# EasyEDA Pro project ProPrj_通用工程PCB-Update-V3.1_2025-07-16.epro, board [PCB]Driver_Board
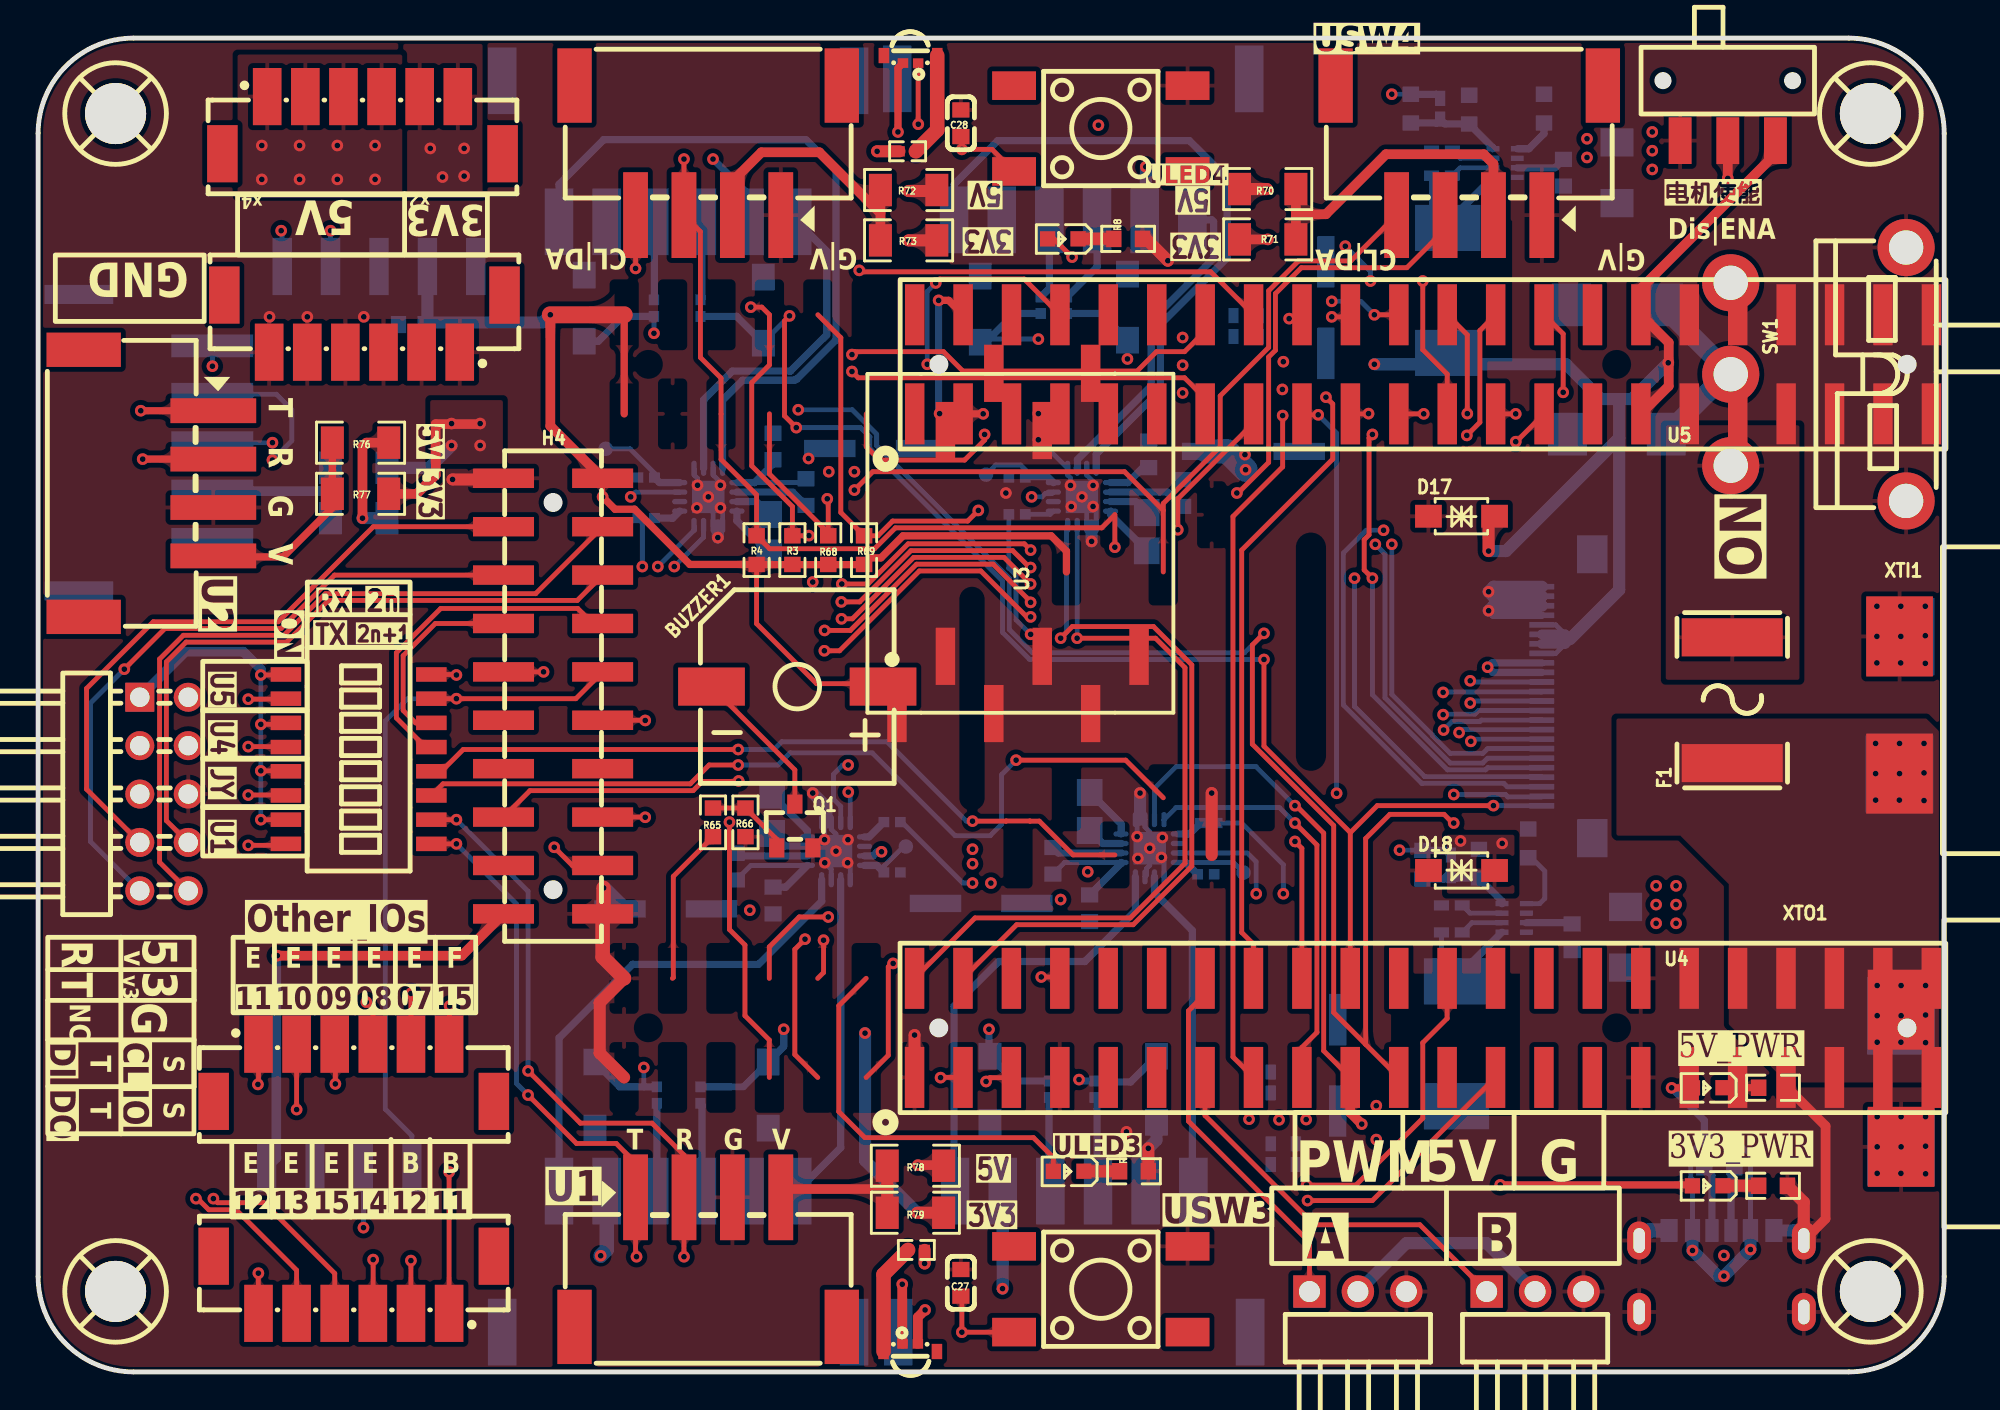
[diagram p11: board, top side]
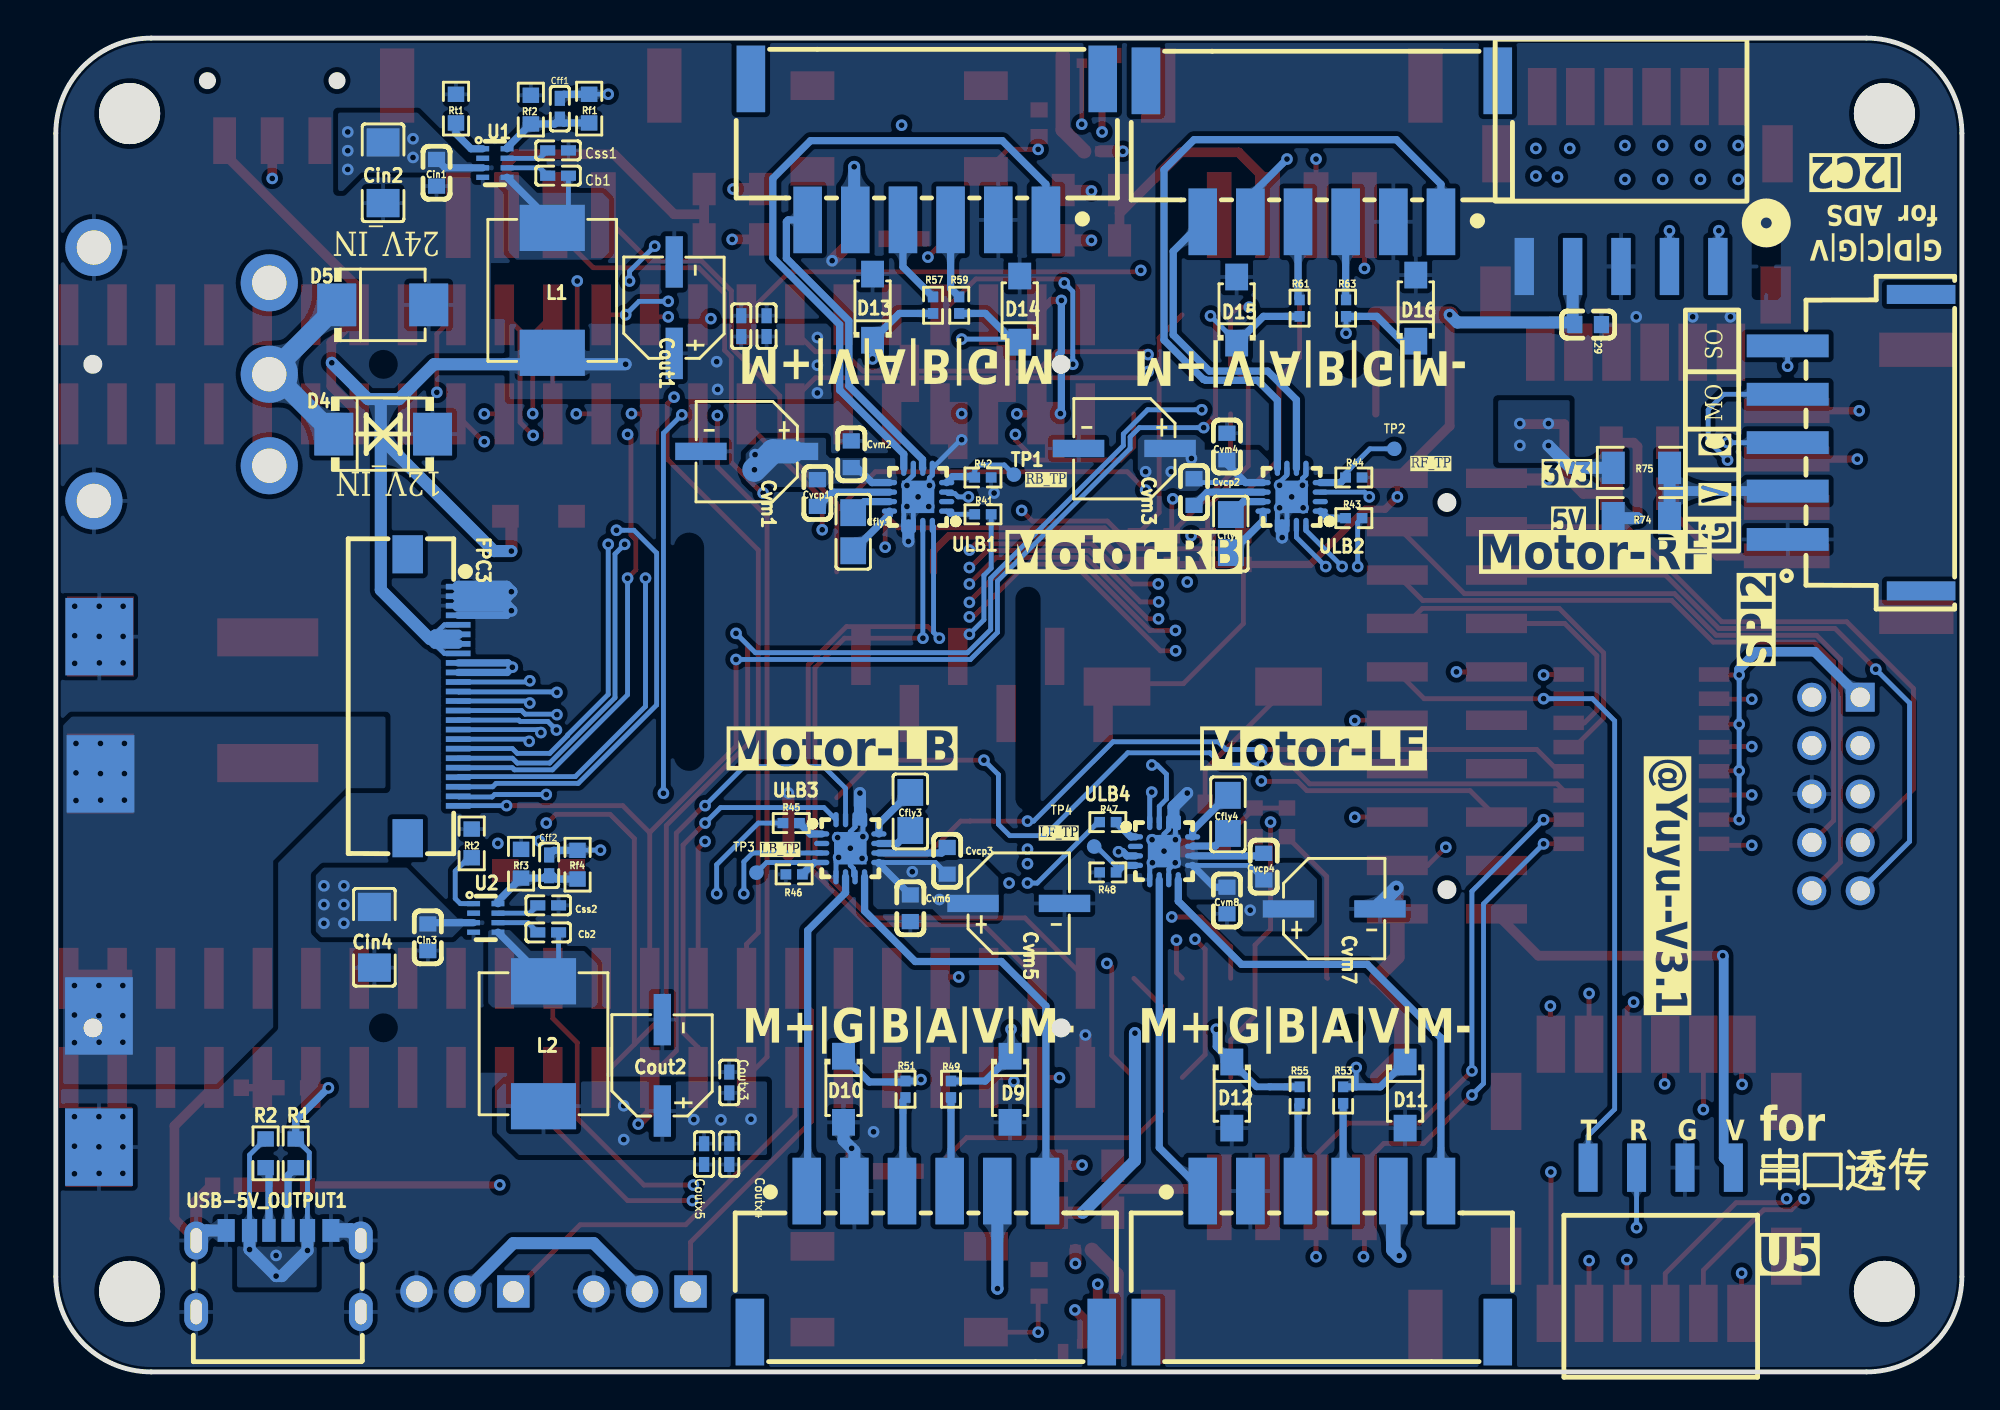
[diagram p12: board, bottom side, seen from below]

Outline 100 x 70 mm; copper layers: Top Layer, SIG1, PWR, GND, SIG2_PWR, Bottom Layer. Coordinates in mm from the lower left corner of the outline.
Outline path: 0,65 0,5 arc(1.46,1.46) 5,0 95,0 arc(98.54,1.46) 100,5 100,65 arc(98.54,68.54) 95,70 5,70 arc(1.46,68.54) 0,65
Stack: Top Layer 0.035mm 外层铜厚1oz / Dielectric1 0.0994mm 3313 RC57% 4.2mil / SIG1 0.0152mm 内层铜厚 / Dielectric2 0.55mm 0.55mm H/H No copper / PWR 0.0152mm 内层铜厚 / Dielectric3 0.1088mm 2116 RC54% 4.9mil / GND 0.0152mm 内层铜厚 / Dielectric4 0.55mm 0.55mm H/H No copper / SIG2_PWR 0.0152mm 内层铜厚 / Dielectric5 0.0994mm 3313 RC57% 4.2mil / Bottom Layer 0.035mm 外层铜厚1oz

## Design rules (mm)
template: 自定义配置
spacing copperThickness1oz (default): track to track 0.102, other pairs 0.152 to 0.3
spacing copperThickness2oz: track to track 0.203, other pairs 0.152 to 0.3
track width copperThickness1oz (default): min 0.127, default 0.254, max 2.54
track width copperThickness2oz: min 0.203, default 0.254, max 2.54
differential pair differentialPair (default): width min 0.127, default 0.254, max 2.54; gap min 0.152, default 0.152
via viaSize (default): diameter min 0.5, default 0.61, max 10; hole min 0.3, default 0.305, max 6.3
net $1N1524 uses copperRegion1
net $1N2727 uses copperRegion1
net VCC uses copperRegion1
net BAT_VCC uses copperRegion1

## Placement (name value [footprint] x y rotation side)
 电机使能   -  [SW-SMD_3P-L9.1-W3.5-P2.50_BDKG-3P-H2MM]  88.65 64.62 180 top
BUZZER1  2.7kHz  [BUZ-SMD_L9.6-W9.6-LS10.0-R]  39.83 35.97 0 top
C27  100nF  [C0603]  48.41 4.67 90 top
C28  100nF  [C0603]  48.41 65.53 90 top
C29  100nF  [C0603]  19.61 54.97 0 bottom
Cb1  100nF  [C0402]  73.65 62.78 0 bottom
Cb2  100nF  [C0402]  74.17 23.06 0 bottom
Cff1  10pF  [C0402]  73.56 66.29 270 bottom
Cff2  18pF  [C0402]  74.12 26.58 270 bottom
Cfly1  22nF  [C0805]  58.17 44.09 90 bottom
Cfly2  22nF  [C0805]  38.35 43.99 90 bottom
Cfly3  22nF  [C0805]  55.17 29.41 270 bottom
Cfly4  22nF  [C0805]  38.51 29.26 270 bottom
Cin1  100nF  [C0603]  80.03 62.93 90 bottom
Cin2  10uF  [C1206]  82.83 62.93 90 bottom
Cin3  100nF  [C0603]  80.48 22.81 90 bottom
Cin4  10uF  [C1206]  83.29 22.81 90 bottom
CN3  XDWF-2500-04P  [CONN-SMD_4P-P2.54_MXXH-2.54-04P-WT1-0-A]  35.15 5.76 0 top
CN9  XDWF-2500-04P  [CONN-SMD_4P-P2.54_MXXH-2.54-04P-WT1-0-A]  75.08 64.11 180 top
CN10  XDWF-2500-04P  [CONN-SMD_4P-P2.54_MXXH-2.54-04P-WT1-0-A]  35.15 64.11 180 top
CN11  X6511FRS-04-C85D30  [HDR-SMD_4P-P2.54-H-F]  15.8 10.72 180 bottom
CN12  XDWF-2500-04P  [CONN-SMD_4P-P2.54_MXXH-2.54-04P-WT1-0-A]  5.79 46.63 270 top
Cout1  33uF  [CAP-SMD_BD5.0-L5.3-W5.3-LS6.3-FD]  67.56 55.85 90 bottom
Cout2  33uF  [CAP-SMD_BD5.0-L5.3-W5.3-LS6.3-FD]  68.18 16.09 90 bottom
Coutx1  820nF  [C0402]  64.04 54.88 270 bottom
Coutx2  820nF  [C0402]  62.71 54.88 270 bottom
Coutx3  820nF  [C0402]  64.67 15.19 270 bottom
Coutx4  820nF  [C0402]  64.67 11.43 90 bottom
Coutx5  820nF  [C0402]  65.99 11.43 90 bottom
Css1  22nF  [C0402]  73.65 64.11 0 bottom
Css2  33nF  [C0402]  74.17 24.49 0 bottom
Cvcp1  100nF  [C0603]  60.05 46.13 270 bottom
Cvcp2  100nF  [C0603]  40.28 46.18 270 bottom
Cvcp3  100nF  [C0603]  53.24 26.82 90 bottom
Cvcp4  100nF  [C0603]  36.63 26.52 90 bottom
Cvm1  33uF  [CAP-SMD_BD5.0-L5.3-W5.3-LS6.3-FD]  63.75 48.31 0 bottom
Cvm2  100nF  [C0603]  58.27 48.16 90 bottom
Cvm3  33uF  [CAP-SMD_BD5.0-L5.3-W5.3-LS6.3-FD]  43.94 48.46 0 bottom
Cvm4  100nF  [C0603]  38.56 48.56 90 bottom
Cvm5  33uF  [CAP-SMD_BD5.0-L5.3-W5.3-LS6.3-FD]  49.48 24.59 180 bottom
Cvm6  100nF  [C0603]  55.17 24.33 270 bottom
Cvm7  33uF  [CAP-SMD_BD5.0-L5.3-W5.3-LS6.3-FD]  32.93 24.3 180 bottom
Cvm8  100nF  [C0603]  38.56 24.74 270 bottom
D4  SMBJ15CA  [SMB_L4.6-W3.6-LS5.4-BI]  82.82 49.22 0 bottom
D5  SMBJ26CA  [SMB_L4.6-W3.6-LS5.4-RD]  82.85 56 180 bottom
D9  SMF3.3A  [SOD-123FL_L2.7-W1.8-LS3.8-RD]  49.94 14.83 270 bottom
D10  SMF3.3A  [SOD-123FL_L2.7-W1.8-LS3.8-RD]  58.67 14.83 270 bottom
D11  SMF3.3A  [SOD-123FL_L2.7-W1.8-LS3.8-RD]  29.21 14.53 270 bottom
D12  SMF3.3A  [SOD-123FL_L2.7-W1.8-LS3.8-RD]  38.3 14.53 270 bottom
D13  SMF3.3A  [SOD-123FL_L2.7-W1.8-LS3.8-RD]  57.15 55.88 90 bottom
D14  SMF3.3A  [SOD-123FL_L2.7-W1.8-LS3.8-RD]  49.43 55.78 90 bottom
D15  SMF3.3A  [SOD-123FL_L2.7-W1.8-LS3.8-RD]  38.05 55.73 90 bottom
D16  SMF3.3A  [SOD-123FL_L2.7-W1.8-LS3.8-RD]  28.65 55.83 90 bottom
D17  SMF6.5CA  [SOD-123FL_L2.7-W1.8-LS3.8-BI]  74.68 44.91 0 top
D18  SMF5.0CA  [SOD-123FL_L2.7-W1.8-LS3.8-BI]  74.68 26.31 180 top
F1  BSMD2920-200-33V  [F2920]  88.88 35.25 90 top
FPC3  AFC01-S24FCA-00  [FPC-SMD_24P-P0.50_AFC01-S24FCA-00]  80.21 35.46 270 bottom
H1  YZT1070-06104-03025-01  [HDR-TH_3P-P2.54-H-M-W9.7-N]  69.24 4.22 0 top
H2  YZT1070-06104-03025-01  [HDR-TH_3P-P2.54-H-M-W9.7-N]  78.54 4.22 0 top
H3  HX PZ2.54-2x5P WC-A  [HDR-TH_10P-P2.54-H-M-R2-C5-S2.54-2]  6.6 30.33 270 top
H4  HX PZ2.54-2x10P TP-D  [HDR-SMD_20P-排母]  27.02 35.47 270 top
H5  -  [卧帖1x5p]  15.34 58.01 0 bottom
L1  7.8uH  [IND-SMD_L7.3-W6.6]  73.96 56.76 90 bottom
L2  5.6uH  [IND-SMD_L7.3-W6.6]  74.41 17.22 90 bottom
LED0  LTST-C191KSKT  [LED0603-RD-YELLOW]  87.59 9.77 180 top
LED17  LTST-C191KSKT  [LED0603-RD-YELLOW]  87.59 14.91 180 top
LED23  MHS110RGBCT  [LED-ARRAY-SMD_MHS110RGBCT]  45.75 1.27 180 top
LED24  MHS110RGBCT  [LED-ARRAY-SMD_MHS110RGBCT]  45.77 68.89 0 top
Motor-LB  ZX-XH2.54-6PWT  [CONN-SMD_ZX-XH2.54-6PWT]  54.36 5.79 180 bottom
Motor-LF  ZX-XH2.54-6PWT  [CONN-SMD_ZX-XH2.54-6PWT]  33.58 5.79 180 bottom
Motor-RB  ZX-XH2.54-6PWT  [CONN-SMD_ZX-XH2.54-6PWT]  54.31 64.16 0 bottom
Motor-RF  ZX-XH2.54-6PWT  [CONN-SMD_ZX-XH2.54-6PWT]  33.58 64.06 0 bottom
NOREF  -  [Pad_e29911]  97.74 18.68 0 top
NOREF#2  -  [Pad_e29912]  97.74 11.8 0 top
NOREF#3  -  [Pad_e29909]  97.66 31.39 0 top
NOREF#4  -  [Pad_e29910]  97.72 38.59 0 top
Q1  -  [S8050_SOT-23]  39.57 28.65 270 top
R1  56K  [R0603]  87.41 11.47 270 bottom
R2  56K  [R0603]  88.99 11.47 270 bottom
R3  10K  [R0603]  39.57 43.13 270 top
R4  10K  [R0603]  37.69 43.13 270 top
R5  1K  [R0603]  91.02 9.77 0 top
R7  1K  [R0603]  57.49 10.53 0 top
R8  1K  [R0603]  57.19 59.46 0 top
R41  4.7K  [R0402]  51.36 45.01 0 bottom
R42  3.3kΩ  [R0402]  51.36 46.94 180 bottom
R43  4.7K  [R0402]  31.9 44.81 0 bottom
R44  3.3kΩ  [R0402]  31.9 46.94 180 bottom
R45  4.7K  [R0402]  61.42 28.8 180 bottom
R46  3.3kΩ  [R0402]  61.26 26.11 0 bottom
R47  4.7K  [R0402]  44.81 28.85 180 bottom
R48  3.3kΩ  [R0402]  44.81 26.21 0 bottom
R49  1K  [R0402]  53.03 14.83 270 bottom
R51  1K  [R0402]  55.42 14.83 270 bottom
R53  1K  [R0402]  32.46 14.53 270 bottom
R55  1K  [R0402]  34.75 14.53 270 bottom
R57  1K  [R0402]  53.98 55.98 90 bottom
R59  1K  [R0402]  52.6 55.98 90 bottom
R61  1K  [R0402]  34.75 55.83 90 bottom
R63  1K  [R0402]  32.31 55.83 90 bottom
R65  1K  [R0603]  35.41 28.84 90 top
R66  10K  [R0603]  37.11 28.84 90 top
R67  4.7K  [R0603]  91.02 14.91 0 top
R68  10K  [R0603]  41.45 43.13 270 top
R69  10K  [R0603]  43.33 43.13 270 top
R70  0Ω  [R1206]  64.51 62.08 0 top
R71  0Ω  [R1206]  64.51 59.44 0 top
R72  0Ω  [R1206]  45.67 62.03 180 top
R73  0Ω  [R1206]  45.67 59.39 180 top
R74  0Ω  [R1206]  16.81 44.81 180 bottom
R75  0Ω  [R1206]  16.81 47.45 180 bottom
R76  0Ω  [R1206]  16.92 48.77 180 top
R77  0Ω  [R1206]  16.92 46.08 180 top
R78  0Ω  [R1206]  46.03 10.82 180 top
R79  0Ω  [R1206]  46.03 8.35 180 top
R80  1K  [R0402]  46.08 6.4 0 top
R81  1K  [R0402]  45.62 64.06 180 top
Rf1  52.3kΩ  [R0603]  72.02 66.3 270 bottom
Rf2  10kΩ  [R0603]  75.08 66.25 270 bottom
Rf3  10kΩ  [R0603]  75.59 26.67 270 bottom
Rf4  30.9kΩ  [R0603]  72.63 26.62 270 bottom
Rt1  23.7kΩ  [R0603]  79 66.3 90 bottom
Rt2  24.9kΩ  [R0603]  78.18 27.74 90 bottom
SCREW1  -  [M3螺丝]  4.06 66.04 0 top
SCREW2  -  [M3螺丝]  4.06 4.22 0 top
SCREW3  -  [M3螺丝]  96.13 66.04 0 top
SCREW4  -  [M3螺丝]  96.13 4.22 0 top
SW1  SS-12D11G5R  [SW-TH_SS-12D11G5R]  93.4 52.36 270 top
SW2  DSHP08TSGER  [SW-SMD_16P-L11.7-W5.4-P1.27-LS8.5]  16.81 32.16 90 top
TP1  -  [Test-Point-0.5mm]  49.73 47.09 180 bottom
TP2  -  [Test-Point-0.5mm]  29.78 48.45 180 bottom
TP3  -  [Test-Point-0.5mm]  63.24 26.2 180 bottom
TP4  -  [Test-Point-0.5mm]  45.53 27.57 180 bottom
U1  TPS62933DRLR  [SOT-583-8_L2.1-W1.2-P0.50-LS1.6-BR]  76.97 63.44 0 bottom
U2  TPS62933DRLR  [SOT-583-8_L2.1-W1.2-P0.50-LS1.6-BR]  77.44 23.83 0 bottom
U3  JY901S  [DRIVERUSING_SMD_JY901S]  51.41 43.48 90 top
U4  -  [贴片排母-定位柱 2x22p]  57.41 18.05 0 top
U5  -  [贴片排母-定位柱 2x22p]  57.42 52.88 0 top
U9  UK-2.54-5AWT  [CONN-SMD_5P-P2.54_USAKRO_UK-2.54-5AWT]  5.64 48.77 90 bottom
U16  WAFER-HY2.0-6PLB  [CONN-SMD_6P-P2.00_XUNPU_WAFER-HY2.0-6PLB]  16.56 15.7 0 top
U17  WAFER-HY2.0-6PLB  [CONN-SMD_6P-P2.00_XUNPU_WAFER-HY2.0-6PLB]  16.56 4.57 180 top
U18  WAFER-HY2.0-6PLB  [CONN-SMD_6P-P2.00_XUNPU_WAFER-HY2.0-6PLB]  17.12 55.02 180 top
U19  WAFER-HY2.0-6PLB  [CONN-SMD_6P-P2.00_XUNPU_WAFER-HY2.0-6PLB]  17.02 65.43 0 top
ULB1  DRV8876RGTR  [VFQFN-16_L3.0-W3.0-P0.50-BL-EP1.7]  54.76 45.92 90 bottom
ULB2  DRV8876RGTR  [VFQFN-16_L3.0-W3.0-P0.50-BL-EP1.7]  35.16 45.92 90 bottom
ULB3  DRV8876RGTR  [VFQFN-16_L3.0-W3.0-P0.50-BL-EP1.7]  58.32 27.48 270 bottom
ULB4  DRV8876RGTR  [VFQFN-16_L3.0-W3.0-P0.50-BL-EP1.7]  41.86 27.33 270 bottom
ULED3  LTST-C191KSKT  [LED0603-RD-YELLOW]  54.07 10.53 180 top
ULED4  LTST-C191KSKT  [LED0603-RD-YELLOW]  53.76 59.46 180 top
USB-5V_OUTPUT1  -  [USB_ TYPE-C-6P]  88.44 5.28 180 bottom
USW3  KH-6X6X5H-STM  [SW-SMD_4P-L6.0-W6.0-P4.50-LS9.0_H5.0]  55.75 4.34 0 top
USW4  KH-6X6X5H-STM  [SW-SMD_4P-L6.0-W6.0-P4.50-LS9.0_H5.0]  55.75 65.25 0 top
XTI1  -  [XT60PW]  95.91 35 0 top
XTO1  -  [XT60PW]  95.99 15.41 0 top

## Footprints (pads in the part's own frame, mm; a bottom-side part is the same pattern mirrored in y, then rotated)
BUZ-SMD_L9.6-W9.6-LS10.0-R
  rect 3.5x2 smd: 1(4.5,0) 2(-4.5,0)
C0402
  rect 0.79x0.54 smd: 1(-0.545,0) 2(0.545,0)
C0603
  rect 0.8x0.9 smd: 1(-0.7,0) 2(0.7,0)
C0805
  rect 1.41x1.35 smd: 1(-1,0) 2(1,0)
C1206
  rect 1.485x1.728 smd: 1(-1.593,0) 2(1.593,0)
CAP-SMD_BD5.0-L5.3-W5.3-LS6.3-FD
  rect 2.7x0.91 smd: 1(-2.4,0) 2(2.4,0)
CONN-SMD_4P-P2.54_MXXH-2.54-04P-WT1-0-A
  rect 1.3x4.5 smd: 1(-3.809,3.4) 2(-1.27,3.4) 3(1.27,3.4) 4(3.81,3.4)
  rect 1.8x3.9 smd: 5(7.01,-3.4) 6(-7.01,-3.4)
CONN-SMD_5P-P2.54_USAKRO_UK-2.54-5AWT
  rect 1.2x4.3 smd: 1(-5.08,3.5) 2(-2.54,3.5) 3(0,3.5) 4(2.54,3.5) 5(5.08,3.5)
  rect 1x3.6 smd: 6(7.78,-3.5) 7(-7.78,-3.5)
CONN-SMD_6P-P2.00_XUNPU_WAFER-HY2.0-6PLB
  rect 1.5x3 smd: 1(-5,1.5) 2(-3,1.5) 3(-1,1.5) 4(1,1.5) 5(3,1.5) 6(5,1.5)
  rect 1.6x3 smd: 7(7.35,-1.5) 8(-7.35,-1.5)
CONN-SMD_ZX-XH2.54-6PWT
  rect 1.5x3.5 smd: 1(-6.25,3.7) 2(-3.75,3.7) 3(-1.25,3.7) 4(1.25,3.7) 5(3.75,3.7) 6(6.25,3.7) 7(-9.23,-3.7) 8(9.23,-3.7)
DRIVERUSING_SMD_JY901S
  rect 3x1.02 smd: 1(-8.932,6.351) 2(-5.932,3.81) 3(-8.932,1.27) 4(-5.932,-1.27) 5(-8.932,-3.81) 6(-5.932,-6.35) 7(8.921,-3.81) 8(5.92,-1.27) 9(8.921,1.27) 10(5.92,3.81)
F2920
  rect 2x5.3 smd: 1(-3.3,0) 2(3.3,0)
FPC-SMD_24P-P0.50_AFC01-S24FCA-00
  rect 0.3x1.3 smd: 1(-5.75,1.325) 2(-5.25,1.325) 3(-4.75,1.325) 4(-4.25,1.325) 5(-3.75,1.325) 6(-3.25,1.325) 7(-2.75,1.325) 8(-2.25,1.325) 9(-1.75,1.325) 10(-1.25,1.325) 11(-0.75,1.325) 12(-0.25,1.325) 13(0.25,1.325) 14(0.75,1.325) 15(1.25,1.325) 16(1.75,1.325) 17(2.25,1.325) 18(2.75,1.325) 19(3.25,1.325) 20(3.75,1.325) 21(4.25,1.325) 22(4.75,1.325) 23(5.25,1.325) 24(5.75,1.325)
  rect 2x1.6 smd: 25(7.449,-1.325) 26(-7.45,-1.325)
HDR-SMD_4P-P2.54-H-F
  rect 1x2.54 smd: 1(-3.81,0) 2(-1.27,0) 3(1.27,0) 4(3.81,0)
HDR-SMD_20P-排母
  rect 1.02x3.2 smd: 1(-11.43,-2.6) 2(-11.43,2.6) 3(-8.89,-2.6) 4(-8.89,2.6) 5(-6.35,-2.6) 6(-6.35,2.6) 7(-3.81,-2.6) 8(-3.81,2.6) 9(-1.27,-2.6) 10(-1.27,2.6) 11(1.27,-2.6) 12(1.27,2.6) 13(3.81,-2.6) 14(3.81,2.6) 15(6.35,-2.6) 16(6.35,2.6) 17(8.89,-2.6) 18(8.89,2.6) 19(11.43,-2.6) 20(11.43,2.6)
HDR-TH_3P-P2.54-H-M-W9.7-N
  rect 1.7x1.7 hole 1.1: 1(-2.54,0)
  round 1.7 hole 1.1: 2(0,0) 3(2.54,0)
HDR-TH_10P-P2.54-H-M-R2-C5-S2.54-2
  rect 1.52x1.52 hole 1.02: 1(-5.08,-1.27)
  round 1.52 hole 1.02: 2(-5.08,1.27) 3(-2.54,-1.27) 4(-2.54,1.27) 5(0,-1.27) 6(0,1.27) 7(2.54,-1.27) 8(2.54,1.27) 9(5.08,-1.27) 10(5.08,1.27)
IND-SMD_L7.3-W6.6
  rect 2.424x3.42 smd: 1(3.278,0) 2(-3.278,0)
LED0603-RD-YELLOW
  rect 0.8x0.8 smd: 1(-0.799,-0.004) 2(0.799,0.004)
LED-ARRAY-SMD_MHS110RGBCT
  rect 0.55x0.5 smd: 1(0.4,-0.2) 4(-0.4,-0.2)
  rect 0.55x0.8 smd: 2(1.4,0.2) 3(-1.4,0.2)
M3螺丝
  round 3.2 hole 3.2: 1(0,0)
Pad_e29909
  rect 3.556x4.064 smd far side: 1(0,0)
Pad_e29910
  rect 3.556x4.064 smd far side: 1(0,0)
Pad_e29911
  rect 3.556x4.064 smd far side: 1(0,0)
Pad_e29912
  rect 3.556x4.064 smd far side: 1(0,0)
R0402
  rect 0.566x0.54 smd: 1(-0.433,0) 2(0.433,0)
R0603
  rect 0.806x0.864 smd: 1(-0.753,0) 2(0.753,0)
R1206
  rect 1.208x1.701 smd: 1(-1.479,0) 2(1.479,0)
S8050_SOT-23
  rect 1x0.8 smd: 1(1.15,-0.823) 2(1.15,1.077) 3(-1.15,0.127)
SMB_L4.6-W3.6-LS5.4-BI
  rect 2.047x2.241 smd: 1(-2.591,0) 2(2.591,0)
SMB_L4.6-W3.6-LS5.4-RD
  rect 2.047x2.241 smd: 1(-2.413,0) 2(2.413,0)
SOD-123FL_L2.7-W1.8-LS3.8-BI
  rect 1.4x1.2 smd: 1(-1.735,0) 2(1.735,0)
SOD-123FL_L2.7-W1.8-LS3.8-RD
  rect 1.4x1.2 smd: 1(-1.735,0) 2(1.735,0)
SOT-583-8_L2.1-W1.2-P0.50-LS1.6-BR
  rect 0.68x0.28 smd: 1(0.64,-0.75) 2(0.64,-0.25) 3(0.64,0.25) 4(0.64,0.75) 5(-0.64,0.75) 6(-0.64,0.25) 7(-0.64,-0.25) 8(-0.64,-0.75)
SW-SMD_3P-L9.1-W3.5-P2.50_BDKG-3P-H2MM
  rect 1.2x2.45 smd: 1(-2.5,0) 2(0,0) 3(2.5,0)
SW-SMD_4P-L6.0-W6.0-P4.50-LS9.0_H5.0
  rect 2.3x1.5 smd: 1(-4.55,2.25) 2(4.55,2.25) 3(-4.55,-2.25) 4(4.55,-2.25)
SW-SMD_16P-L11.7-W5.4-P1.27-LS8.5
  rect 0.76x1.6 smd: 1(-4.445,-3.815) 2(-3.175,-3.815) 3(-1.905,-3.815) 4(-0.635,-3.815) 5(0.635,-3.815) 6(1.905,-3.815) 7(3.175,-3.815) 8(4.445,-3.815) 9(-4.445,3.815) 10(-3.175,3.815) 11(-1.905,3.815) 12(-0.635,3.815) 13(0.635,3.815) 14(1.905,3.815) 15(3.175,3.815) 16(4.445,3.815)
SW-TH_SS-12D11G5R
  round 3 hole 1.8: 1(-4.8,-4.6) 2(0,-4.6) 3(4.8,-4.6) 4(6.65,4.6) 5(-6.65,4.6)
Test-Point-0.5mm
  round 0.762 smd: 1(0,0)
USB_ TYPE-C-6P
  oval 1.25x2 hole 0.6x1.3: 7(-4.193,1.611) 8(4.447,1.611) 9(-4.193,-2.139) 10(4.447,-2.139)
  rect 0.7x1.2 smd: A5(-0.373,2.139) B5(0.627,2.139)
  rect 0.8x1.2 smd: A9(1.647,2.139) B9(-1.393,2.139)
  rect 0.9x1.2 smd: A12(2.877,2.139) B12(-2.623,2.139)
VFQFN-16_L3.0-W3.0-P0.50-BL-EP1.7
  oval 0.28x0.8 smd: 1(-0.75,-1.5) 2(-0.249,-1.5) 3(0.249,-1.5) 4(0.749,-1.5) 9(0.749,1.5) 10(0.249,1.5) 11(-0.249,1.5) 12(-0.75,1.5)
  oval 0.8x0.28 smd: 5(1.5,-0.75) 6(1.5,-0.249) 7(1.5,0.249) 8(1.5,0.749) 13(-1.5,0.749) 14(-1.5,0.249) 15(-1.5,-0.249) 16(-1.5,-0.75)
  rect 1.7x1.7 smd: 17(0,0)
XT60PW
  custom 3.5x4.2 smd: 1(1.75,-3.6) 2(1.75,3.6)
卧帖1x5p
  rect 1.02x3 smd: 1(-2.54,0) 2(0,0) 3(2.54,0) 4(5.08,0) 5(7.62,0)
贴片排母-定位柱 2x22p
  rect 1.02x3.2 smd: 1(-11.43,-2.6) 2(-8.89,-2.6) 3(-6.35,-2.6) 4(-3.81,-2.6) 5(-1.27,-2.6) 6(1.27,-2.6) 7(3.81,-2.6) 8(6.35,-2.6) 9(8.89,-2.6) 10(11.43,-2.6) 11(13.97,-2.6) 12(16.51,-2.6) 13(19.05,-2.6) 14(21.59,-2.6) 15(24.13,-2.6) 16(26.67,-2.6) 17(29.21,-2.6) 18(31.75,-2.6) 19(34.29,-2.6) 20(36.83,-2.6) 21(39.37,-2.6) 22(41.91,-2.6) 23(-11.43,2.6) 24(-8.89,2.6) 25(-6.35,2.6) 26(-3.81,2.6) 27(-1.27,2.6) 28(1.27,2.6) 29(3.81,2.6) 30(6.35,2.6) 31(8.89,2.6) 32(11.43,2.6) 33(13.97,2.6) 34(16.51,2.6) 35(19.05,2.6) 36(21.59,2.6) 37(24.13,2.6) 38(26.67,2.6) 39(29.21,2.6) 40(31.75,2.6) 41(34.29,2.6) 42(36.83,2.6) 43(39.37,2.6) 44(41.91,2.6)

## Nets
As in the schematic, except:
5V:  电机使能 .1 BUZZER1.1 C29.2 Cff1.1 CN11.4 Cout1.1 Coutx1.2 Coutx2.2 D17.2 FPC3.5 FPC3.6 FPC3.7 FPC3.8 H1.2 H2.2 H3.2 H4.2 H4.19 H5.5 L1.2 LED17.2 Motor-LB.5 Motor-LF.5 Motor-RB.5 Motor-RF.5 R1.1 R2.1 R3.2 R4.2 R68.2 R69.2 R70.1 R72.1 R74.1 R76.1 R78.1 R80.2 R81.2 Rf1.1 U3.10 U5.1 U5.22 U5.23 U5.44 U19.1 U19.2 U19.3 U19.4 USB-5V_OUTPUT1.A9 USB-5V_OUTPUT1.B9
GND:  电机使能 .3 C27.2 C28.2 C29.1 Cin1.1 Cin2.1 Cin3.1 Cin4.1 CN3.3 CN9.1 CN10.1 CN11.3 CN12.3 Cout1.2 Cout2.2 Coutx1.1 Coutx2.1 Coutx3.1 Coutx4.1 Coutx5.1 Css1.1 Css2.1 Cvm1.2 Cvm2.2 Cvm3.2 Cvm4.2 Cvm5.2 Cvm6.2 Cvm7.2 Cvm8.2 D4.1 D5.2 D9.2 D10.2 D11.2 D12.2 D13.2 D14.2 D15.2 D16.2 D17.1 D18.2 FPC3.1 FPC3.2 FPC3.3 FPC3.4 H1.3 H2.3 H3.6 H4.1 H4.20 H5.1 H5.4 Motor-LB.2 Motor-LF.2 Motor-RB.2 Motor-RF.2 NOREF#2.1 NOREF#4.1 Q1.2 R5.2 R7.2 R8.2 R42.2 R44.2 R46.2 R48.2 R66.1 R67.2 Rf2.1 Rf3.1 Rt1.2 Rt2.2 SW1.4 SW1.5 U1.4 U2.4 U3.5 U3.7 U4.1 U4.7 U4.10 U4.22 U4.23 U4.44 U5.2 U9.1 U18.1 U18.2 U18.3 U18.4 U18.5 U18.6 ULB1.5 ULB1.7 ULB1.13 ULB1.14 ULB1.17 ULB2.5 ULB2.7 ULB2.13 ULB2.14 ULB2.17 ULB3.5 ULB3.7 ULB3.13 ULB3.14 ULB3.17 ULB4.5 ULB4.7 ULB4.13 ULB4.14 ULB4.17 USB-5V_OUTPUT1.7 USB-5V_OUTPUT1.8 USB-5V_OUTPUT1.9 USB-5V_OUTPUT1.10 USB-5V_OUTPUT1.A12 USB-5V_OUTPUT1.B12 USW3.2 USW4.2 XTI1.2 XTO1.1
BAT_VCC: F1.1 NOREF.1 NOREF#3.1 XTI1.1 XTO1.2
NSLEEP_CTRL:  电机使能 .2 R41.1 R43.1 R45.1 R47.1

Pads without a net: CN3 5 6; CN9 5 6; CN10 5 6; CN12 5 6; FPC3 25 26; H3 5; H4 11 13 14 17; LED23 3; LED24 3; Motor-LB 7 8; Motor-LF 7 8; Motor-RB 7 8; Motor-RF 7 8; SCREW1 1; SCREW2 1; SCREW3 1; SCREW4 1; SW1 1; U1 2; U2 2; U3 1 2 6; U4 2 3 11 12 18 20 21 25 31 33 34 39 41 42 43; U5 5 7 9 11 12 21 24 25 28 29 31 33 34 43; U9 6 7; U16 7 8; U17 7 8; U18 7 8; U19 7 8; ULB1 2; ULB2 2; ULB3 2; ULB4 2; USW3 1 4; USW4 1 4

## Via types
v1: diameter 0.61, hole 0.305, Top Layer to Bottom Layer, 313 vias

## Routing (per net, layer and track width the routed paths; a pad name or vN(x,y) marks a point on that pad's centre or on a via; arc(x,y) is an arc through that point)
3V3: length 157.1
  Top Layer w0.381: v1(76.71,9.81) 86.74,9.81 LED0.2
  Top Layer w0.508: R71.1 v1(64.52,59.44) ; R77.1 18.4,46.08 19.86,46.08 20.86,47.07 20.86,49.74 23.16,49.74 v1(23.19,49.77)
  Top Layer w0.635: R79.1 v1(46.13,8.35) ; R73.1 v1(45.67,59.39)
  SIG1 w0.254: v1(70.21,13.97) 69.65,14.53 69.65,25.6 v1(71.43,27.38)
  GND w0.508: v1(76.05,36.98) 73.91,39.12 73.91,44.91 72.03,46.79 66.95,46.79 64.52,49.22 v1(64.52,59.44)
  GND w0.635: v1(52.12,45.92) 50.29,47.75 47.8,47.75 45.67,49.89 v1(45.67,59.39)
  SIG2_PWR w0.508: v1(21.69,48.62) 19.05,48.62 9.75,39.32 9.75,34.59 8.03,32.87 H3.4
  SIG2_PWR w0.762: v1(21.69,48.62) v1(21.69,49.77) 21.69,62.23 v1(21.22,62.71) ; v1(23.19,49.77) v1(23.19,48.62)
  Bottom Layer w0.254: v1(31.09,45.92) 31.34,46.17 ULB2.3 ; v1(71.43,27.38) 72.62,27.38 Rf4.1 ; v1(63.91,25.09) 63.9,25.1 63.9,26.78 63.44,27.23 ULB3.3 ; ULB1.3 53.18,46.09 52.83,46.09 52.66,45.92 v1(52.12,45.92)
  Bottom Layer w0.381: Rf4.1 73.88,27.37 Cff2.1 ; FPC3.9 76.27,37.21 v1(76.05,36.98) 76.32,36.71 FPC3.10 ; v1(44.25,27.3) 44.02,27.3 43.8,27.08 ULB4.3
  Bottom Layer w0.635: R75.1 20.52,47.45 v1(21.69,48.62) ; v1(46.13,8.35) 43.38,11.1 v1(43.38,17.78)
  vias: v1(20.57,64.21) v1(22.35,64.21) v1(22.35,62.76) v1(63.53,13.26) v1(65.1,13.23) v1(66.53,13.24) v1(70.21,12.19) v1(74.62,27.87) v1(76.81,27.74)
5V: length 271.8
  Top Layer w0.254: BUZZER1.1 44.18,36.12 40.84,36.12 37.69,39.27 R4.2 ; v1(29.62,45.92) H4.2
  Top Layer w0.381: v1(29.62,45.92) 30.26,45.28 31.29,45.28 34.19,42.38 R4.2 ; 53.95,41.98 53.95,43.08 53.15,43.88 45.37,43.88 44.22,42.72 43.68,42.72 43.32,42.37 37.69,42.37 ; LED17.2 v1(85.7,14.91) ; 30.75,55.48 30.75,50.28
  Top Layer w0.508: R78.1 47.47,10.85 v1(46.16,10.85) ; 84.09,50.28 85.55,51.74 85.55,54.02 84.09,55.48 84.09,56.86 91.15,63.92  电机使能 .1 ; v1(12.55,21.84) 22.22,21.84 H4.19 ; v1(26.87,55.48) 26.87,49.64 H4.2 ; R76.1 17.22,48.77 17.02,48.56 v1(17.02,44.81)
  Top Layer w0.635: D17.2 76.1,44.59 v1(76.1,43.08) ; R80.2 v1(46.51,5.69) ; R81.2 v1(44.02,64.06) ; R72.1 47.1,61.98 v1(45.67,61.98) ; R70.1 v1(64.47,62.08)
  Top Layer w0.889: 30.75,55.48 v1(26.87,55.48)
  SIG1 w0.254: v1(70.1,52.88) 69.19,53.8 69.19,65.23 v1(71.02,67.06)
  SIG1 w0.635: v1(58.12,63.25) 63.3,63.25 v1(64.47,62.08)
  SIG2_PWR w0.762: H1.2 77.01,11.99 85.29,11.99 88.44,8.84 v1(88.44,6.11) v1(88.44,5.03)
  Bottom Layer w0.254: 80.12,38.21 79.62,37.71 FPC3.8 ; 69.04,4.22 H1.2 ; R2.1 89.84,11.38 USB-5V_OUTPUT1.B9 ; v1(71.02,67.06) 72.01,67.06 Rf1.1 ; 80.11,38.71 79.61,39.21 FPC3.5 ; R1.1 86.7,11.51 86.7,10.2 86.8,10.1 USB-5V_OUTPUT1.A9
  Bottom Layer w0.381: Rf1.1 73.35,67.05 Cff1.1 ; v1(35.41,63.65) 37.33,61.73 Motor-RF.5 ; R1.1 87.41,13.19 v1(85.7,14.91)
  Bottom Layer w0.508: v1(12.55,21.84) 12.5,21.79 12.5,11.23 CN11.4 ; FPC3.6 80.11,38.71 80.37,38.46 80.12,38.21 FPC3.7
  Bottom Layer w0.635: 82.95,51.05 83.62,51.05 v1(85.52,52.96) ; 82.95,51.05 81.99,51.05 80.16,52.88 v1(70.1,52.88) ; 82.95,51.05 82.95,49.02 ; v1(76.1,43.08) 77.01,43.08 82.95,49.02 ; 20.42,55.08 26.47,55.08 v1(26.87,55.48) ; 20.42,55.08 C29.2 ; 20.42,55.08 20.42,57.71 ; USB-5V_OUTPUT1.A9 v1(86.8,6.37) 88.14,5.03 v1(88.44,5.03) v1(89.84,6.42) USB-5V_OUTPUT1.B9 ; 82.95,49.02 82.95,41.04 80.37,38.46 ; H1.2 71.78,6.76 76,6.76 H2.2 ; v1(58.12,63.25) 58.12,60.52 Motor-RB.5 ; v1(50.6,4.37) 50.61,4.38 50.61,9.49 ; R74.1 v1(17.02,44.81)
  Bottom Layer w0.762: 29.83,9.49 29.83,6.41 v1(29.51,6.1)
  vias: v1(11.73,64.36) v1(11.73,62.59) v1(13.72,64.36) v1(13.72,62.59) v1(15.7,64.36) v1(15.7,62.59) v1(17.68,64.36) v1(17.68,62.59) v1(60.05,54.29) v1(60.05,52.83) v1(60.05,51.38) v1(65.33,53.02) v1(65.28,51.56)
GND: length 83.4
  Top Layer w0.508: USB-5V_OUTPUT1.7 93.78,8.03 93.78,12.91 R67.2
  Top Layer w0.635: H4.1 24.36,46.84 v1(21.74,46.84) ; v1(59.27,58.32) 58.13,59.46 57.94,59.46 ; U4.1 v1(45.98,17.68) ; 30.74,20.65 29.46,19.38 29.46,16.73 30.74,15.45 ; R5.2 92.64,8.9 USB-5V_OUTPUT1.7 ; R7.2 v1(58.25,11.74) ; 61.57,27.13 v1(61.57,30.38)
  Top Layer w0.762: v1(29.67,25.4) 29.67,24.09 H4.20 29.62,21.78 30.74,20.65
  Bottom Layer w0.254: ULB2.7 35.41,47.07 35.8,46.69 v1(35.8,46.53) ; v1(57.66,28.09) 57.66,28.89 ; ULB3.14 58.06,28.98 58.06,28.6 58.32,28.35 v1(58.32,27.48) 58.32,26.59 58.15,26.42 58.15,26.06 ULB3.7 ; v1(54.76,45.92) 55.01,45.67 ULB1.14 ULB1.13 55.51,45.26 v1(55.35,45.42) ; 58.06,28.98 57.57,28.98 ; ULB4.5 42.61,26.58 v1(42.47,26.72) ; v1(34.59,46.53) 34.59,46.89 34.41,47.07 ULB2.5 ; v1(35.16,45.92) 35.41,45.67 ULB2.14 ULB2.13 35.91,45.23 v1(35.8,45.35) ; v1(55.35,46.52) 55.35,46.74 55.01,47.07 ULB1.7 ; v1(41.86,27.33) 41.86,28.23 41.61,28.48 ULB4.14 ULB4.13 41.11,28.64 41.26,28.49 v1(41.26,27.93) ; v1(54.16,46.52) 54.16,46.92 54.01,47.07 ULB1.5 52.52,48.92 v1(52.48,48.92) ; ULB4.7 41.61,26.38 v1(41.27,26.72) ; v1(58.93,27) 59.07,26.86 ULB3.5
  Bottom Layer w0.381: v1(76.1,39.95) 76.34,39.71 FPC3.4
  Bottom Layer w0.635: v1(55.27,43.59) 55.27,44.41 55.25,44.42 ; v1(76.1,39.95) 76.36,40.21 FPC3.3 ; USB-5V_OUTPUT1.B12 92.11,7.42 USB-5V_OUTPUT1.7 ; FPC3.1 76.36,41.21 v1(76.1,40.94) 76.34,40.71 FPC3.2 ; 57.81,28.98 v1(57.81,30.38) ; 41.36,28.83 41.36,29.66 v1(40.64,30.38) ; 35.67,44.42 35.66,44.41 v1(35.66,43.79) ; 58.11,9.49 58.11,11.59 v1(58.25,11.74) 58.67,12.16 D10.2
  Bottom Layer w0.762: v1(29.67,25.4) 30.53,24.54 Cvm7.2 ; USB-5V_OUTPUT1.8 84.52,7.42 USB-5V_OUTPUT1.A12
  vias: v1(12.14,55.37) v1(14.12,55.37) v1(17.09,55.37) v1(34.56,45.35) v1(42.49,27.93) v1(50.77,46.12) v1(54.2,45.42) v1(57.1,12.6) v1(57.7,26.95) v1(58.98,28.04) v1(96.47,40.18) v1(96.47,38.6) v1(96.47,37.21) v1(96.48,13.39) v1(96.48,11.81) v1(96.48,10.42) v1(97.72,40.18) v1(97.72,38.6) v1(97.72,37.21) v1(97.74,13.39) v1(97.74,11.81) v1(97.73,10.42) v1(99.01,40.18) v1(99.01,38.64) v1(99.01,37.19) v1(99.02,13.39) v1(99.02,11.85) v1(99.02,10.4)
VCC: length 152.9
  SIG2_PWR w0.635: v1(37.34,24.23) 37.9,24.79 v1(53.65,24.79) ; 41.48,47.94 v1(41.48,47.24) ; 41.48,47.94 42.81,47.94 ; 41.48,47.94 v1(40.42,47.94) ; 42.81,47.94 42.82,47.93 61.59,47.93 62.23,47.3 63.3,47.3 v1(63.35,47.35) ; 42.81,47.94 42.81,47.25 v1(42.82,47.24)
  SIG2_PWR w1.27: 53.65,26.25 v1(55.07,26.25) ; 53.65,26.25 53.65,33.38 65.58,45.31 81.68,45.31 83.71,47.35 64.11,47.35 ; 53.65,26.25 v1(53.65,24.79) ; 64.11,47.35 v1(63.35,47.35) ; 64.11,47.35 v1(63.32,48.14)
  SIG2_PWR w2.032: 88.8,52.36 88.72,52.36 83.79,47.43
  Bottom Layer w0.254: 37.58,46.67 40.08,46.67 40.28,46.88 ; 40.36,26.58 37.39,26.58 Cvcp4.1 ; ULB3.9 53.85,26.73 Cvcp3.1
  Bottom Layer w0.381: ULB1.9 57.18,46.67 57.96,47.46 Cvm2.1 ; ULB3.9 56.82,26.68 Cvm6.1 ; U2.3 80.42,23.58 Cin3.2 ; 40.36,26.58 39.22,25.44 Cvm8.1 ; Cvm4.1 38.56,47.65 37.58,46.67 ULB2.9 ; 77.61,63.19 79.59,63.19 80.03,63.63
  Bottom Layer w1.016: D5.1 85.26,55.9 88.8,52.36 88.56,52.36 D4.2
  Bottom Layer w1.27: v1(63.35,47.35) 62.38,48.31 Cvm1.1
  vias: v1(81.26,64.72) v1(81.26,63.74) v1(84.68,65.08) v1(84.68,64.09) v1(84.68,63.11) v1(84.89,25.51) v1(84.89,24.53) v1(84.89,23.54) v1(85.93,25.51) v1(85.93,24.53) v1(85.93,23.54)
A0-RF_ENC_A: length 72.9
  Top Layer w0.254: v1(64.31,37.39) 64.31,32.84 68.84,28.31 68.84,28.3 ; v1(39.42,55.42) 39.16,55.16 39.16,50.18 v1(39.78,49.56) ; 68.84,28.3 70.26,29.72 v1(76.35,29.72) ; 68.84,28.3 68.84,20.65
  Bottom Layer w0.254: D15.1 38.05,54.05 v1(39.42,55.42) ; v1(76.35,29.72) 78.88,29.72 FPC3.24 ; v1(39.78,49.56) 43.15,49.56 43.64,49.07 43.64,48.47 50.6,41.51 50.6,38.81 52.02,37.39 v1(64.31,37.39)
  Bottom Layer w0.381: R61.1 36.65,55.4 D15.1
A1-RF_ENC_B: length 95.5
  Top Layer w0.254: 69.65,17.19 67.97,18.86 67.97,28.68 63.7,32.94 63.7,38.15 v1(64.31,38.76) ; 69.65,17.19 69.65,27.99 70.92,29.26 73.76,29.26 74.22,28.8 v1(74.27,28.8) ; 69.65,17.19 71.38,15.45
  SIG1 w0.254: v1(74.27,28.8) v1(74.27,30.3)
  GND w0.254: v1(39.88,50.5) 35.87,54.51 v1(32.31,54.51)
  Bottom Layer w0.254: v1(74.27,30.3) 76.98,30.3 77.11,30.17 78.85,30.17 FPC3.23 ; v1(39.88,50.5) 42.72,50.5 43.99,49.22 43.99,48.61 50.95,41.65 50.95,38.96 52.17,37.74 63.3,37.74 v1(64.31,38.76) ; v1(32.31,54.51) R63.1
  Bottom Layer w0.381: R63.1 30.69,55.4 29.39,54.09 D16.1
A8-DRIVER_I2C2_SDA: length 93.1
  Top Layer w0.254: CN9.4 68.87,58.31 66.13,58.31 64.56,56.74 64.56,53.76 62.02,51.22 62.02,48.56 59.03,45.58 59.03,45.21 ; CN10.4 v1(31.34,57.91) ; v1(37.39,55.88) 37.97,55.88 38.37,55.48 38.37,52.85 37.44,51.92 37.44,47.55 39.57,45.42 R3.1 40.43,43.88 v1(40.44,43.89) ; v1(42.82,46.28) 43.79,47.24 57,47.24 59.03,45.21 ; 59.03,41.98 59.03,45.21
  SIG1 w0.254: v1(12.75,59.89) 14.73,57.91 v1(31.34,57.91) 36.53,57.91 37.39,57.05 v1(37.39,55.88) ; v1(42.82,46.28) v1(40.44,43.89)
  Bottom Layer w0.254: 12.8,57.71 12.8,59.84 v1(12.75,59.89)
A9-DRIVER_I2C2_SCL: length 95.1
  Top Layer w0.254: CN9.3 73.81,59.95 71.81,57.95 66.27,57.95 64.91,56.59 64.91,53.62 64.56,53.26 64.56,47.73 62.95,46.13 v1(62.89,46.13) ; v1(56.49,43.28) 56.49,44.98 55.8,44.3 44.98,44.3 43.88,43.2 38.38,43.2 R4.1 37.69,46.03 35.83,47.89 35.83,52.16 34.75,53.24 34.75,59.85 CN10.3 v1(33.88,63.65)
  SIG1 w0.254: v1(56.49,43.28) 60.05,43.28 v1(62.89,46.13) ; v1(15.34,59.89) 22.86,59.89 26.62,63.65 v1(33.88,63.65)
  Bottom Layer w0.254: v1(15.34,59.89) 15.34,57.71
B4-ULED4_DRIVER: length 60
  Top Layer w0.254: ULED4.2 53.29,59.46 v1(54.25,58.51) ; v1(36.27,28.85) 36.27,23.22 37.08,22.4 37.08,18.69 38.36,17.42 38.36,15.45
  SIG1 w0.254: v1(40.64,41.45) 40.64,34.07 36.27,29.7 v1(36.27,28.85)
  SIG2_PWR w0.254: v1(40.64,41.45) 38.25,43.84 38.25,49.89 43.43,55.07 51.92,55.07 54.25,57.4 v1(54.25,58.51)
B5-STEPA_DIR: length 51
  Top Layer w0.254: 38.36,20.65 38.36,22.31 39.93,23.88 v1(41.45,23.88)
  SIG2_PWR w0.254: v1(75.13,36.27) 71.63,36.27 70.21,34.85 70.21,29.67 67.79,27.25 60.01,27.25 56.68,23.93 41.5,23.93 v1(41.45,23.88)
  Bottom Layer w0.254: FPC3.11 75.2,36.21 v1(75.13,36.27)
B6-STEPA_STEP: length 55
  Top Layer w0.254: v1(40.23,22.71) 39.7,22.18 39.7,16.66 40.9,15.45
  SIG2_PWR w0.254: v1(40.23,22.71) 40.81,23.29 56.55,23.29 60.16,26.9 67.94,26.9 70.56,29.52 70.56,34.7 71.52,35.66 v1(73.71,35.66)
  Bottom Layer w0.254: v1(73.71,35.66) 73.74,35.69 78.87,35.69 FPC3.12
B7-STEPB_DIR: length 47.8
  Top Layer w0.254: 40.9,20.65 41.21,20.96 v1(41.21,22.66)
  SIG2_PWR w0.254: v1(75.13,35.1) 75.11,35.08 71.8,35.08 70.92,34.19 70.92,29.37 68.09,26.54 60.31,26.54 56.7,22.94 41.49,22.94 v1(41.21,22.66)
  Bottom Layer w0.254: FPC3.13 75.24,35.21 v1(75.13,35.1)
B9-STEPB_STEP: length 48.9
  Top Layer w0.254: v1(44.86,21.44) 44.78,21.44 44.6,21.26 44.6,16.61 43.44,15.45
  SIG2_PWR w0.254: v1(73.71,34.49) 71.83,34.49 71.27,33.93 71.27,29.22 68.24,26.19 60.48,26.19 56.84,22.56 45.97,22.56 v1(44.86,21.44)
  Bottom Layer w0.254: FPC3.14 75.56,34.71 75.38,34.52 73.74,34.52 v1(73.71,34.49)
B10-SERVO_SIG_TX: length 33.1
  Top Layer w0.254: 66.31,50.28 66.36,50.23 v1(67.16,50.23)
  SIG1 w0.254: v1(68.12,30.37) 72.19,30.37 74.91,33.09 v1(75.17,33.09)
  Bottom Layer w0.254: FPC3.17 75.28,33.21 v1(75.17,33.09) ; v1(68.12,30.37) 68.12,49.26 v1(67.16,50.23)
B11: length 90
  Top Layer w0.254: U17.1 21.56,10.49 v1(21.56,10.49) ; 66.31,55.48 66.1,55.28 v1(65.63,55.28)
  SIG1 w0.254: v1(65.63,55.28) 46.2,55.28 44.87,53.95 44.87,23.29 41.95,20.37 30.58,20.37 29.71,19.5 29.71,17.33 22.88,10.49 v1(21.56,10.49)
B12: length 93.8
  Top Layer w0.254: v1(59.79,44.2) 59.79,45.82 63.77,49.8 63.77,50.28 ; v1(19.56,5.84) 19.56,3.07 U17.2
  SIG1 w0.254: v1(59.79,44.2) 52.9,51.09 52.9,52.75 51.43,54.22 46.21,54.22 45.58,53.59 45.58,22.99 42.25,19.66 36.32,19.66 33.22,16.56 30.28,16.56 v1(19.56,5.84)
B13-DRIVER_SPI2_SCK: length 59.3
  Top Layer w0.254: 63.77,55.48 61.51,57.73 43.16,57.73 v1(43.08,57.81)
  SIG1 w0.254: v1(12.29,48.77) 13.37,48.77 15.76,51.16 32.93,51.16 34.88,53.11 38.38,53.11 v1(43.08,57.81)
  Bottom Layer w0.254: v1(12.29,48.77) U9.3
B14-DRIVER_SPI2_MISO: length 61.8
  Top Layer w0.254: 61.23,50.28 61.23,51.09 60.15,52.17 43.03,52.17 v1(42.7,52.5)
  SIG1 w0.254: v1(42.7,52.5) 42.6,52.4 35.18,52.4 33.22,50.44 16.05,50.44 12.65,47.04 10.36,47.04 9.14,48.26 v1(9.14,52.78)
  Bottom Layer w0.254: v1(9.14,52.78) 9.14,53.84 U9.5
B15-DRIVER_SPI2_MOSI: length 61
  Top Layer w0.254: v1(42.7,53.39) 42.85,53.54 47.5,53.54 48.51,52.53 57.66,52.53 58.67,53.54 60.15,53.54 61.23,54.62 61.23,55.48
  SIG1 w0.254: v1(12.29,47.85) 12.96,47.85 15.91,50.8 33.08,50.8 35.03,52.76 42.06,52.76 v1(42.7,53.39)
  Bottom Layer w0.254: U9.4 12.5,51.31 13.31,50.5 13.31,48.87 v1(12.29,47.85)
BAT_VCC:
  vias: v1(96.4,32.98) v1(96.4,31.4) v1(96.4,30.01) v1(96.48,20.28) v1(96.48,18.69) v1(96.48,17.3) v1(97.65,30.01) v1(97.66,32.98) v1(97.66,31.4) v1(97.74,20.28) v1(97.74,18.69) v1(97.73,17.3) v1(98.94,32.98) v1(98.94,31.44) v1(98.94,29.99) v1(99.02,20.28) v1(99.02,18.73) v1(99.02,17.28)
C0-RB_ENC_A: length 50.4
  Top Layer w0.254: v1(65.29,50.19) 65.29,47.5 62.69,44.89 62.69,16.53 63.76,15.45
  SIG1 w0.254: v1(65.29,50.19) 60.12,50.19 v1(57.15,53.16)
  Bottom Layer w0.254: v1(57.15,53.16) D13.1
  Bottom Layer w0.381: D13.1 55.75,55.55 R57.1
C1-RB_ENC_B: length 55.9
  Top Layer w0.254: v1(67.56,51.16) 67.92,50.8 67.92,47.9 63.14,43.13 63.14,23.06 63.76,22.45 63.76,20.65
  SIG1 w0.254: v1(67.56,51.16) 66.4,52.32 61.87,52.32 60.5,53.7 59.8,53.7 58.99,54.51 52.79,54.51 v1(52.48,54.2)
  Bottom Layer w0.254: v1(52.48,54.2) 49.59,54.2 D14.1
  Bottom Layer w0.381: 49.89,54.2 51.23,55.55 R59.1
C2-LB_IN: length 21.6
  Top Layer w0.254: 66.3,15.45 66.3,17.03 67.09,17.81 67.09,27.65 v1(65.94,28.8)
  Bottom Layer w0.254: v1(65.94,28.8) 65.13,29.62 59.7,29.62 ULB3.16
C3-LF_IN: length 33.9
  Top Layer w0.254: 66.3,20.65 66.3,27.48 v1(65.94,27.84)
  GND w0.254: v1(42.5,30.43) 44.79,28.14 53.95,28.14 54.48,28.68 62.66,28.68 63.5,27.84 v1(65.94,27.84)
  Bottom Layer w0.254: v1(42.5,30.43) 42.61,30.33 ULB4.16
C4-USART1_TX: length 80.2
  Top Layer w0.254: v1(66.55,9.8) 69.14,9.8 72.64,13.31 72.64,17.27 73.92,18.55 73.92,20.65 ; v1(31.39,6.04) 31.34,6.1 CN3.1 31.22,9.29 31.22,11.1 30.33,11.99 28.25,11.99 v1(25.7,14.53) ; SW2.1 v1(21.95,27.71)
  SIG1 w0.254: v1(66.55,9.8) 35.15,9.8 v1(31.39,6.04)
  Bottom Layer w0.254: v1(21.95,27.71) 25.09,24.56 25.09,15.14 v1(25.7,14.53)
C5-USART1_RX: length 77.9
  Top Layer w0.254: SW2.2 v1(21.95,28.98) ; v1(66.6,8.99) 70,8.99 76.46,15.45 ; v1(33.88,6.04) CN3.2 33.88,11.38 32.21,13.06 28.45,13.06 v1(25.7,15.8)
  SIG1 w0.254: v1(66.6,8.99) 36.83,8.99 v1(33.88,6.04)
  Bottom Layer w0.254: v1(21.95,28.98) 25.7,25.22 v1(25.7,15.8)
C6-LB_ENC_A: length 44.9
  Top Layer w0.381: 48.53,50.28 v1(49.58,50.28)
  SIG1 w0.381: v1(49.58,50.28) 47.78,48.48 47.78,21.06 53.49,15.34 v1(54.61,15.34)
  Bottom Layer w0.381: 55.42,15.22 57.32,15.22 D10.1 ; v1(54.61,15.34) 54.69,15.27 R51.1
C7-LB_ENC_B: length 46.1
  Top Layer w0.381: 48.53,55.48 47.77,56.24 v1(47.24,56.24)
  SIG1 w0.381: v1(47.29,50.29) 47.29,20.57 v1(49.89,17.98)
  Bottom Layer w0.381: R49.1 51.24,15.27 D9.1 49.89,16.62 v1(49.89,17.98) ; v1(47.29,50.29) 47.24,50.34 47.24,52.56 47.37,52.69 47.37,53.4 47.24,53.52 v1(47.24,56.24)
C8-ADVANCE_I2C3_SCL: length 58.7
  Top Layer w0.254: 40.91,55.48 42.11,54.28 42.11,45.1 R69.1 44.06,43.88 44.83,44.65 48.77,44.65 v1(49.33,45.21)
  GND w0.254: v1(70.16,43.43) 68.81,44.78 49.76,44.78 v1(49.33,45.21)
  Bottom Layer w0.254: FPC3.19 76.04,32.21 75.79,31.95 74.09,31.95 70.66,35.38 70.66,42.93 v1(70.16,43.43)
C9-ADVANCE_I2C3_SDA: length 58.4
  Top Layer w0.254: 38.37,50.28 38.37,47.12 41.45,44.04 ; 41.45,44.04 R68.1 ; 41.45,44.04 41.45,45.77 v1(41.4,45.82)
  GND w0.254: v1(71.02,43.43) 70.98,43.43 70.4,42.85 69.91,42.85 68.34,44.42 62.64,44.42 61.8,43.59 59.58,43.59 58.99,44.17 43.05,44.17 v1(41.4,45.82)
  Bottom Layer w0.254: v1(71.02,43.43) 71.02,35.56 73.15,33.42 73.15,33.39 74.09,32.46 75.79,32.46 76.05,32.72 78.88,32.72 FPC3.18
C10-UART4_TX: length 18
  Top Layer w0.254: H4.8 29.1,39.28 28.31,40.07 21.12,40.07 18.8,37.74 18.8,34.32 20.33,32.79 SW2.5
C11-UART4_RX: length 10.6
  Top Layer w0.254: SW2.6 19.81,34.06 19.15,34.71 19.15,37.59 20.84,39.28 H4.7
C12-UART5_TX: length 37.8
  Top Layer w0.254: SW2.7 v1(21.95,35.33) 28.21,35.33 H4.10
  Bottom Layer w0.254: v1(21.95,35.33) 19.38,35.33 18.22,34.17 18.22,13.79 19.61,12.39 19.61,10.72
D0-ADVANCE_CAN_RX: length 54
  Top Layer w0.254: v1(31.85,29.11) 31.84,29.12 H4.16
  SIG1 w0.254: v1(49.02,26.67) 49.88,26.67 54.22,31.01 72,31.01 v1(74.55,33.55)
  SIG2_PWR w0.254: v1(31.85,29.11) 35.27,25.69 47.79,25.69 48.76,26.67 v1(49.02,26.67)
  Bottom Layer w0.254: FPC3.16 74.7,33.71 v1(74.55,33.55)
D1-ADVANCE_CAN_TX: length 59.5
  Top Layer w0.254: v1(36.75,31.01) 36.73,30.99 34.84,30.99 34.36,30.51 25.81,30.51 H4.15
  SIG1 w0.254: v1(73.74,33.69) 71.41,31.36 54.07,31.36 50.14,27.43 v1(49.02,27.43)
  SIG2_PWR w0.254: v1(36.75,31.01) 44.53,31.01 48.11,27.43 v1(49.02,27.43)
  Bottom Layer w0.254: FPC3.15 75.71,34.21 75.64,34.14 74.19,34.14 v1(73.74,33.69)
D2-UART5_RX: length 42.7
  Top Layer w0.254: H4.18 28.03,26.58 v1(27.08,27.53) ; SW2.8 21.92,36.6 v1(21.95,36.58)
  SIG2_PWR w0.254: v1(21.95,36.58) 22,36.58 27.08,31.5 v1(27.08,27.53) 20.62,21.08 20.62,13.77 17.07,10.21 v1(17.07,7.57)
  Bottom Layer w0.254: v1(17.07,7.57) CN11.2
D5-BUZZER: length 8.3
  Top Layer w0.254: R65.1 33.32,26 33.32,20.7 33.28,20.65
D12-LF_ENC_A: length 103.1
  Top Layer w0.381: 53.61,50.28 52.49,50.28 v1(52.48,50.29)
  SIG1 w0.381: v1(52.48,50.29) 52.48,52.58 51.26,53.8 46.38,53.8 46,53.42 46,19.12 43.28,16.4 40.7,16.4 v1(39.12,17.98)
  GND w0.254: v1(52.48,50.29) 54.11,50.29 59.21,45.19 69.57,45.19 v1(70.59,44.17)
  Bottom Layer w0.254: FPC3.22 77.08,30.71 76.9,30.89 72.59,30.89 68.48,35 68.48,42.98 69.67,44.17 v1(70.59,44.17)
  Bottom Layer w0.355: 36.31,14.96 37,14.96 D12.1
  Bottom Layer w0.381: v1(39.12,17.98) 39.12,17.08 D12.1 ; R55.1 36.31,14.96
D13-LF_ENC_B: length 119
  Top Layer w0.254: 53.61,55.48 51.73,57.36 47.3,57.36 v1(47.09,57.15)
  SIG1 w0.254: v1(31.78,15.98) 43.45,15.98 46.65,19.17 v1(46.65,52.88)
  GND w0.254: v1(47.09,57.15) 47.75,57.15 59.36,45.54 70.54,45.54 71.78,44.3 71.78,43.37 70.65,42.24 69.65,42.24 v1(69.06,41.66)
  Bottom Layer w0.254: v1(46.65,52.88) 46.65,56.71 v1(47.09,57.15) ; v1(31.78,15.98) 31.78,14.97 31.77,14.96 ; v1(69.06,41.66) 69.06,34.92 72.74,31.24 78.85,31.24 FPC3.21
  Bottom Layer w0.381: D11.1 30.51,14.96 R53.1
DEBUG_RX: length 20.9
  Top Layer w0.254: SW2.14 12.92,33.98 v1(11.68,33.98) ; SW2.12 12.97,31.55 v1(11.68,31.55) ; v1(11.68,36.58) 12.97,36.58 SW2.16 ; SW2.10 v1(11.68,28.98)
  Bottom Layer w0.254: v1(11.68,28.98) v1(11.68,31.55) v1(11.68,33.98) v1(11.68,36.58)
  Bottom Layer w0.508: v1(11.68,36.58) 11.68,36.88 10.77,37.8 7.72,37.8 H3.1
DEBUG_TX: length 37.1
  Top Layer w0.254: SW2.13 12.97,32.82 v1(11.02,32.82) ; v1(11.02,30.28) 12.97,30.28 SW2.11 ; v1(11.02,27.64) 12.92,27.64 SW2.9 ; v1(11.02,35.31) 12.97,35.31 SW2.15
  SIG1 w0.254: 11.02,23.68 v1(11.02,27.64) v1(11.02,30.28) v1(11.02,32.82) v1(11.02,35.31)
  SIG1 w0.508: H3.3 3.56,31.09 3.56,24.54 5.18,22.91 10.25,22.91 11.02,23.68
E0-ULED3_DRIVER: length 20.6
  Top Layer w0.254: ULED3.2 53.27,11.25 52.22,12.29 43.37,12.29 42.01,13.66 42.01,19.22 43.44,20.65
E2-RB_PWM: length 106.1
  Top Layer w0.254: 45.98,20.65 49.15,23.83 57.3,23.83 60.17,26.69 60.17,36.96 58.62,38.51 v1(54.51,38.51)
  Top Layer w0.381: v1(45.11,65.08) 45.11,68.42 45.37,68.69
  SIG2_PWR w0.508: v1(45.11,65.08) 45.72,64.47 46.94,64.47 47.9,65.43 v1(55.63,65.43) 55.63,55.27 51.76,51.41 42.72,51.41 39.04,47.73 39.04,46.55 41.35,44.25 52.48,44.25 54.51,42.22 v1(54.51,38.51)
  Bottom Layer w0.254: v1(54.51,38.51) 54.51,38.51 ULB1.15
E3-RF_PWM: length 74.1
  Top Layer w0.254: 48.52,15.45 47.36,15.45 v1(47.35,15.44) ; 46.17,68.69 46.17,65.49 v1(46.18,65.48)
  SIG2_PWR w0.254: v1(47.35,15.44) 43.24,15.44 31.27,27.42 31.27,34.43 33.38,36.54 v1(33.38,42.27) 33.38,51.26 35.56,53.44 35.56,56.9 44.65,65.99 45.67,65.99 v1(46.18,65.48)
  Bottom Layer w0.254: v1(33.38,42.27) 34.91,43.8 ULB2.15
E4-RB_IN: length 39
  Top Layer w0.254: v1(53.65,38.51) 54.25,39.12 58.52,39.12 60.53,37.11 60.53,26.55 57.45,23.47 51.34,23.47 48.52,20.65
  Bottom Layer w0.254: ULB1.16 53.95,44.36 53.95,38.81 v1(53.65,38.51)
E5-RF_IN: length 44.3
  Top Layer w0.254: v1(49.73,15.24) 49.94,15.44 51.05,15.44 51.06,15.45
  SIG2_PWR w0.254: v1(32.51,42.27) 32.51,36.18 30.91,34.58 30.91,27.27 43.55,14.63 49.12,14.63 v1(49.73,15.24)
  Bottom Layer w0.254: v1(32.51,42.27) 34.41,44.17 ULB2.16
E7: length 86.4
  Top Layer w0.254: U16.5 19.56,17.2 v1(19.56,19.86) ; v1(80.01,51.41) 80.01,54.48 79.01,55.48 ; v1(52.07,39.62) 51.87,39.62 49.46,42.03 46.24,42.03 42.05,37.85 v1(41.25,37.85)
  SIG1 w0.254: v1(80.01,51.41) 80.01,49.89 76.86,46.73 66.63,46.73 59.52,39.62 v1(52.07,39.62) ; v1(41.25,37.85) 41.25,34.18 36.85,29.79 36.85,28.61 31.82,23.58 27.93,23.58 27.4,23.05 27.37,23.05 24.19,19.86 v1(19.56,19.86)
E8: length 87
  Top Layer w0.254: v1(52.07,41.35) 50.67,42.75 45.94,42.75 42.72,39.52 v1(42.15,39.52) ; U16.4 17.56,19.07 v1(17.22,19.41) ; 76.47,50.28 v1(77.52,50.28)
  SIG1 w0.254: v1(17.22,19.41) 17.63,19 17.63,16.26 18.8,15.09 20.45,15.09 28.22,22.86 32.32,22.86 37.57,28.11 37.57,29.49 42.38,34.3 42.38,39.3 v1(42.15,39.52) ; v1(77.52,50.28) 74.69,47.45 66.34,47.45 60.24,41.35 v1(52.07,41.35)
E9: length 88.9
  Top Layer w0.254: U16.3 15.6,17.16 v1(15.6,15.11) ; v1(52.07,42.22) 52.02,42.22 51.13,43.1 45.79,43.1 43.1,40.41 v1(42.14,40.41) ; v1(74.96,49.15) 75.64,49.83 75.64,54.65 76.47,55.48
  SIG1 w0.254: v1(52.07,42.22) 52.12,42.27 60.65,42.27 66.19,47.8 73.61,47.8 v1(74.96,49.15) ; v1(15.6,15.11) 15.98,14.73 20.6,14.73 28.37,22.51 32.47,22.51 37.92,27.96 37.92,29.34 42.73,34.15 42.73,39.82 v1(42.14,40.41)
E10: length 108.2
  Top Layer w0.254: U16.2 13.56,13.77 v1(13.56,13.77) ; v1(72.64,57.25) 72.64,53.64 73.93,52.36 73.93,50.28
  SIG1 w0.254: v1(68.58,59.08) 66.45,56.95 51.04,56.95 49.19,58.8 45.25,58.8 43.44,56.99 43.44,29.06 43.25,28.87 39.85,28.87 32.78,21.8 28.67,21.8 20.03,13.16 14.17,13.16 v1(13.56,13.77) ; v1(69.9,57.25) v1(72.64,57.25)
  Bottom Layer w0.254: v1(68.58,59.08) 69.9,57.76 v1(69.9,57.25)
E11: length 95.3
  Top Layer w0.254: v1(11.53,15.09) 11.56,15.12 U16.1 ; v1(42.16,41.35) 43.54,41.35 45.65,43.46 51.74,43.46 v1(52.07,43.13) ; v1(74.98,50.29) 74.98,54.43 73.93,55.48
  SIG1 w0.254: v1(74.98,50.29) 72.85,48.16 66.04,48.16 60.58,42.7 52.5,42.7 v1(52.07,43.13) ; v1(11.53,15.09) 12.24,14.38 20.74,14.38 28.52,22.15 32.61,22.15 39.69,29.23 42.88,29.23 43.09,29.44 43.09,40.43 v1(42.16,41.35)
E12: length 112.3
  Top Layer w0.254: v1(11.56,5.18) 11.56,3.08 U17.6 ; 71.39,50.28 v1(72.69,50.28)
  SIG1 w0.254: v1(11.56,5.18) 10.18,5.18 9.78,5.59 9.78,9.93 10.57,10.72 10.76,10.72 11.38,11.34 20.9,11.34 25.12,15.56 25.12,16.04 25.46,16.38 26.14,16.38 29.36,19.61 29.36,19.65 30.43,20.73 41.8,20.73 43.66,22.59 43.66,27.54 44.51,28.39 44.51,54.1 46.05,55.63 47.81,55.63 48.04,55.86 65.88,55.86 71.6,50.14 72.55,50.14 v1(72.69,50.28)
E13: length 111.2
  Top Layer w0.254: 71.39,55.48 v1(70.1,55.48) ; v1(8.28,9.09) 8.37,9.09 8.95,8.51 10.39,8.51 13.56,5.34 U17.5
  SIG1 w0.254: v1(67.87,56.19) 67.46,56.59 50.89,56.59 49.04,58.45 45.4,58.45 43.8,56.85 43.8,28.92 43.4,28.51 40,28.51 32.92,21.44 28.81,21.44 20.18,12.8 10.27,12.8 8.28,10.81 v1(8.28,9.09)
  Bottom Layer w0.254: v1(67.87,56.19) 69.4,56.19 v1(70.1,55.48)
E14: length 97.4
  Top Layer w0.254: U17.3 17.58,3.09 v1(17.58,5.89) ; 68.85,50.28 69.79,50.28 v1(69.8,50.29)
  SIG1 w0.254: v1(69.8,50.29) 69.6,50.29 65.02,54.87 46.36,54.87 45.22,53.74 45.22,23.14 42.1,20.02 30.73,20.02 30.07,19.36 30.07,17.18 18.78,5.89 v1(17.58,5.89)
E15: length 111.9
  Top Layer w0.254: 68.85,55.48 68.74,55.37 v1(67.87,55.37) ; U17.4 15.56,5.17 11.85,8.88 9.41,8.88 v1(9.19,9.09)
  SIG1 w0.254: v1(9.19,9.09) 9.19,11.22 10.42,12.45 20.32,12.45 28.96,21.08 41.66,21.08 43.31,22.73 43.31,27.69 44.16,28.54 44.16,56.7 45.55,58.09 48.89,58.09 50.74,56.24 66.34,56.24 67.21,55.37 v1(67.87,55.37)
F2-LB_PWM: length 57.4
  Top Layer w0.254: 68.84,15.45 67.45,16.85 67.45,28.27 66,29.72 v1(65.94,29.72)
  Top Layer w0.508: LED23.4 46.15,2.87 v1(46.53,3.25) ; 68.84,15.45 68.84,13.61 v1(69.44,13)
  GND w0.508: v1(46.53,3.25) 47.35,3.25 55.12,11.02 67.46,11.02 v1(69.44,13)
  Bottom Layer w0.254: v1(65.94,29.72) 63.89,31.76 59.7,31.76 58.57,30.63 ULB3.15
F3-LF_PWM: length 45.5
  Top Layer w0.254: 53.6,20.65 53.53,20.73 v1(52.63,20.73)
  Top Layer w0.508: LED23.1 45.34,1.49 v1(45.34,4.6)
  SIG1 w0.254: v1(52.63,20.73) 49.99,23.37 v1(49.99,25.65)
  GND w0.508: v1(52.63,20.73) 52.63,9.85 47.37,4.6 v1(45.34,4.6)
  SIG2_PWR w0.254: v1(42.5,31.85) 45.01,31.85 48.56,28.3 49.53,28.3 49.99,27.84 v1(49.99,25.65)
  Bottom Layer w0.254: ULB4.15 42.11,29.68 41.73,30.06 41.73,31.37 42.22,31.85 v1(42.5,31.85)
F9-B_RAW_PWM: length 20.6
  Top Layer w0.254: H2.1 72.49,7.72 66.95,7.72 61.22,13.45 61.22,15.45
F10-A_RAW_PWM: length 19.4
  Top Layer w0.254: 61.22,20.65 61.22,19.82 60.35,18.95 60.35,13.16 66.7,6.81 H1.1
F15: length 78.4
  Top Layer w0.254: v1(41.26,38.91) 42.61,38.91 46.09,42.39 50.1,42.39 52.07,40.42 v1(52.07,40.39) ; v1(77.52,48.82) 77.55,48.82 79.01,50.28 ; U16.6 21.59,17.23 v1(21.59,19.2)
  SIG1 w0.254: v1(77.52,48.82) 76.66,48.82 74.93,47.09 66.48,47.09 59.78,40.39 v1(52.07,40.39) ; v1(21.59,19.2) 24.03,19.2 26.47,21.64 26.5,21.64 28.08,23.22 31.97,23.22 37.21,28.47 37.21,29.64 42.02,34.45 42.02,38.15 v1(41.26,38.91)
G2-ADVANCE_ALERT: length 54.2
  Top Layer w0.254: 43.45,50.28 43.45,48.55 44.15,47.85 48.61,47.85 49.66,48.9 v1(49.66,49.2) ; v1(70,41.66) 69.57,42.09 69.57,43.68 69.82,43.93 69.82,49.02 v1(70,49.2)
  SIG2_PWR w0.254: v1(49.66,49.2) 50.06,49.61 69.6,49.61 v1(70,49.2)
  Bottom Layer w0.254: FPC3.20 76.05,31.71 75.94,31.6 73.94,31.6 70,35.54 v1(70,41.66)
G5-USW3_DRIVER: length 50.5
  Top Layer w0.254: C27.1 48.46,3.97 v1(48.46,2.08) 51.2,2.08 51.2,2.09 ; H4.9 v1(26.52,36.74)
  SIG2_PWR w0.254: v1(26.52,36.74) 26.52,32.56 27.43,31.64 27.43,28.65 48.46,7.62 v1(48.46,2.08)
G6-USW4_DRIVER: length 43
  Top Layer w0.254: H4.12 31.84,34.2 v1(31.85,34.19) ; 51.2,63 50.05,64.16 v1(48.46,64.16) 48.46,64.78 C28.1
  SIG2_PWR w0.254: v1(48.46,64.16) 48.46,60.6 37.9,50.04 37.9,40.23 v1(31.85,34.19)
IMU_RX: length 39
  Top Layer w0.254: v1(49.02,28.91) 50.78,28.91 50.78,28.91 52.03,28.91 52.04,28.91 52.53,28.91 54.3,27.13 56.49,27.13 ; SW2.4 21.16,31.52 22.3,32.66 v1(36.73,32.66)
  Bottom Layer w0.254: v1(49.02,28.91) 48.7,28.91 44.53,33.07 39.01,33.07 38.61,32.66 v1(36.73,32.66)
IMU_TX: length 45.1
  Top Layer w0.254: v1(51.31,32.11) 57.06,32.11 59.03,30.13 ; v1(36.73,31.85) 35.2,31.85 34.22,30.86 21.24,30.86 SW2.3
  Bottom Layer w0.254: v1(36.73,31.85) 38.81,31.85 39.45,32.49 43.76,32.49 48.11,28.14 49.95,28.14 50.55,28.74 50.55,31.34 v1(51.31,32.11)
LB_M+: length 17.3
  Bottom Layer w0.381: ULB3.6 58.57,25.15 60.56,23.16 60.56,9.49
LB_M-: length 23.1
  Bottom Layer w0.381: 57.57,25.98 57.57,24.19 54.91,21.54 50.39,21.54 48.06,19.2 48.06,9.49
LF_M+: length 17.3
  Bottom Layer w0.381: ULB4.6 42.11,11.77 39.83,9.49
LF_M-: length 25.9
  Bottom Layer w0.381: 27.33,9.49 27.33,17.52 31.19,21.39 37.79,21.39 41.11,24.7 ULB4.8
NSLEEP_CTRL: length 156.4
  Top Layer w0.508: v1(88.65,62.64)  电机使能 .2
  GND w0.508: v1(88.65,62.64) 92.81,58.47 92.81,42.06 73.3,22.56 65.36,22.56 ; 65.36,22.56 50.9,22.56 49.02,24.44 v1(49.02,25.65) 37.34,25.65 33.53,29.46 33.53,36.32 31.7,38.15 v1(31.7,42.27) 31.7,42.82 32.21,43.33 34.34,43.33 34.85,42.82 50.19,42.82 50.8,42.22 50.8,39.52 51.61,38.71 v1(52.07,38.71) ; 65.36,22.56 65.33,22.58 v1(65.33,25.09)
  Bottom Layer w0.254: R45.1 63.14,28.8 65.33,26.62 v1(65.33,25.09) ; v1(49.02,25.65) 48.51,25.65 45.31,28.85 R47.1 ; v1(52.07,38.71) 51.31,39.47 51.31,41.8 50.93,42.18 R41.1 ; v1(31.7,42.27) 31.7,44.58 R43.1
RB_M+: length 17.1
  Bottom Layer w0.381: Motor-RB.6 61.57,60.46 61.67,60.36 61.67,58.44 58.39,55.17 58.39,51.75 54.53,47.88 54.53,47.44 ULB1.6
RB_M-: length 36
  Bottom Layer w0.381: Motor-RB.1 48.06,62.33 50.34,64.62 60.4,64.62 62.38,62.64 62.38,58.47 58.88,54.97 58.88,51.53 55.51,48.17 ULB1.8
RF_M+: length 18
  Bottom Layer w0.381: ULB2.6 34.91,51.02 36.42,52.52 39.47,52.52 41.38,54.42 41.38,58.81 39.83,60.36
RF_M-: length 37.9
  Bottom Layer w0.381: ULB2.8 35.91,51 36.95,52.04 39.67,52.04 39.72,52.09 39.79,52.09 41.86,54.16 41.86,63.09 40.28,64.67 29.67,64.67 27.33,62.33 27.33,60.36
SWCLK-TCK: length 34.7
  Top Layer w0.254: H3.8 6.73,28.93 6.73,37.26 7.77,38.3 13.04,38.3 15.23,40.49 28.29,40.49 H4.6
SWDIO-TMS: length 38.9
  Top Layer w0.254: H3.10 6.37,26.75 6.37,37.41 7.62,38.66 12.89,38.66 15.08,40.84 26.1,40.84 H4.4
TDI: length 60.6
  Top Layer w0.254: H3.7 2.54,30.58 2.54,35.86 6.05,39.37 12.6,39.37 17.59,44.36 H4.3
  Top Layer w0.381: v1(5.49,47.9) CN12.2
  SIG2_PWR w0.381: H3.7 2.84,30.28 2.84,45.26 v1(5.49,47.9)
TDO: length 67.3
  Top Layer w0.254: v1(4.52,36.88) 6.65,39.01 12.75,39.01 15.55,41.82 H4.5
  Top Layer w0.381: v1(5.39,50.44) CN12.1
  SIG2_PWR w0.381: v1(5.39,50.44) 1.88,46.94 1.88,28.7 H3.9
  Bottom Layer w0.254: v1(4.52,36.88) 2.74,35.1 2.74,27.84 H3.9
$1N289: length 2.3
  Bottom Layer w0.254: Css1.2 74.61,63.69 76.32,63.69
$1N574: length 2.3
  Bottom Layer w0.381: Rt1.1 79,64.98 78.21,64.19 77.61,64.19
$1N771: length 2.3
  Bottom Layer w0.254: Cb1.2 74.61,63.19 76.32,63.19
$1N1524: length 6.7
  Bottom Layer w0.254: L1.1 73.1,60.89 73.1,62.78
  Bottom Layer w0.381: L1.1 73.96,60.32 76.32,62.69
$1N2129: length 3.5
  Bottom Layer w0.381: USB-5V_OUTPUT1.B5 87.82,10.31 R1.2
$1N2130: length 3.4
  Bottom Layer w0.381: USB-5V_OUTPUT1.A5 88.82,10.54 R2.2
$1N2727: length 6.5
  Bottom Layer w0.254: L2.1 73.62,21.29 Cb2.1
  Bottom Layer w0.381: L2.1 74.41,20.69 U2.5
$1N2734: length 2.3
  Bottom Layer w0.254: U2.7 75.12,24.08 Css2.2
$1N2742: length 2.3
  Bottom Layer w0.254: U2.6 75.22,23.58 Cb2.2
$1N2747: length 3.7
  Bottom Layer w0.254: U2.1 78.78,24.58 79.04,24.84 79.04,26.28 78.34,26.98 Rt2.1
$1N7657: length 8
  Top Layer w0.254: 35.33,35.97 39.7,31.59 Q1.3
$1N7660: length 4.5
  Top Layer w0.254: Q1.1 38.75,27.95 R66.2 R65.2
$1N8376: length 1.9
  Top Layer w0.635: 54.56,59.47 56.43,59.47 R8.1
$1N8377: length 1.9
  Top Layer w0.635: ULED3.1 54.87,10.53 R7.1
$1N8578: length 1.9
  Top Layer w0.635: LED0.1 90.26,9.77 R5.1
$1N8581: length 1.9
  Top Layer w0.381: R67.1 90.26,14.92 LED17.1
$1N20736: length 5.1
  Bottom Layer w0.381: Rf1.2 73.35,65.55 Cff1.2 73.81,65.49 Rf2.2 76.32,64.25 76.32,64.19
$1N20769: length 5.1
  Bottom Layer w0.381: Rf4.2 73.74,25.87 74.09,26.22 74.4,25.92 Rf3.2 76.8,24.7 U2.8
$2N2254: length 4.1
  Bottom Layer w0.381: ULB1.10 59.25,46.17 60,45.43 Cvcp1.2
$2N2362: length 2.1
  Bottom Layer w0.381: ULB1.11 57.59,45.67 Cfly1.2
$2N2366: length 2.9
  Bottom Layer w0.381: ULB1.12 56.26,45 Cfly1.1
$2N2640: length 1.5
  Bottom Layer w0.254: ULB1.1 53.1,45.01 R41.2
$2N2889: length 4.3
  Bottom Layer w0.254: TP1.1 50.24,47.6 51.54,47.6 51.79,47.35 51.79,46.99
  Bottom Layer w0.381: 51.79,46.99 52.94,46.99 ULB1.4
$2N3379: length 3.9
  Bottom Layer w0.381: Cvcp2.2 39.59,46.17 ULB2.10
$2N3383: length 2
  Bottom Layer w0.381: Cfly2.2 38.35,45.01 37.69,45.67 ULB2.11
$2N3385: length 2.9
  Bottom Layer w0.381: Cfly2.1 38.34,42.99 36.66,44.67 ULB2.12
$2N3407: length 1.5
  Bottom Layer w0.381: R43.2 33.29,44.81 ULB2.1
$2N3413: length 4.8
  Bottom Layer w0.254: R44.1 32.34,47.17 31.06,48.45 TP2.1
  Bottom Layer w0.381: ULB2.4 32.6,46.67 R44.1
$2N3839: length 3.7
  Bottom Layer w0.381: ULB3.10 53.53,27.23 Cvcp3.2
$2N3843: length 1.9
  Bottom Layer w0.381: Cfly3.2 55.85,27.73 ULB3.11
$2N3845: length 2.9
  Bottom Layer w0.381: ULB3.12 56.82,28.76 Cfly3.1
$2N3867: length 1.4
  Bottom Layer w0.381: ULB3.1 60.41,28.23 R45.2
$2N3873: length 4.5
  Bottom Layer w0.254: ULB3.4 62.71,26.73 TP3.1
  Bottom Layer w0.381: 60.21,26.73 R46.1
$2N4299: length 3.8
  Bottom Layer w0.381: ULB4.10 36.76,27.08 Cvcp4.2
